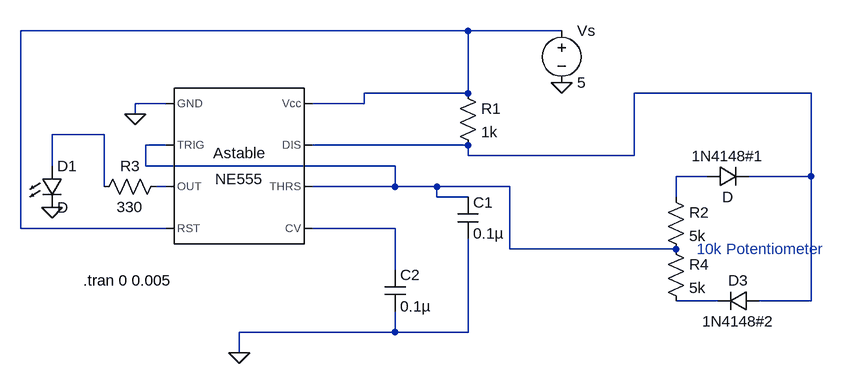
[diagram p0: schematic tj led schematic.asc]
tj led schematic.asc, the LTspice schematic file:
Version 4.1
SHEET 1 1116 680
WIRE 544 -32 -144 -32
WIRE 688 -32 544 -32
WIRE 544 64 544 -32
WIRE 544 64 384 64
WIRE 1072 64 800 64
WIRE 80 80 32 80
WIRE 384 80 384 64
WIRE 384 80 304 80
WIRE 32 96 32 80
WIRE -16 128 -96 128
WIRE 80 144 48 144
WIRE 544 144 304 144
WIRE 544 160 544 144
WIRE 800 160 800 64
WIRE 800 160 544 160
WIRE -96 176 -96 128
WIRE 48 176 48 144
WIRE 432 176 48 176
WIRE 912 192 864 192
WIRE 1072 192 1072 64
WIRE 1072 192 976 192
WIRE -16 208 -16 128
WIRE 80 208 64 208
WIRE 432 208 432 176
WIRE 432 208 304 208
WIRE 496 208 432 208
WIRE 608 208 496 208
WIRE 496 224 496 208
WIRE 544 224 496 224
WIRE 864 224 864 192
WIRE -144 272 -144 -32
WIRE 80 272 -144 272
WIRE 432 272 304 272
WIRE 608 304 608 208
WIRE 864 304 608 304
WIRE 432 336 432 272
WIRE 928 384 864 384
WIRE 1072 384 1072 192
WIRE 1072 384 992 384
WIRE 432 432 432 400
WIRE 432 432 192 432
WIRE 544 432 544 288
WIRE 544 432 432 432
WIRE 192 464 192 432
FLAG 688 48 0
FLAG 32 96 0
FLAG 192 464 0
FLAG -96 240 0
SYMBOL Misc\\NE555 192 176 R0
SYMATTR InstName Astable
SYMBOL cap 528 224 R0
SYMATTR InstName C1
SYMATTR Value 0.1µ
SYMBOL cap 416 336 R0
SYMATTR InstName C2
SYMATTR Value 0.1µ
SYMBOL voltage 688 -48 R0
SYMATTR InstName Vs
SYMATTR Value 5
SYMBOL LED -112 176 R0
SYMATTR InstName D1
SYMBOL res 528 48 R0
SYMATTR InstName R1
SYMATTR Value 1k
SYMBOL res 80 192 R90
WINDOW 0 0 56 VBottom 2
WINDOW 3 32 56 VTop 2
SYMATTR InstName R3
SYMATTR Value 330
SYMBOL res 848 208 R0
SYMATTR InstName R2
SYMATTR Value 5k
SYMBOL res 848 288 R0
SYMATTR InstName R4
SYMATTR Value 5k
SYMBOL diode 912 208 R270
WINDOW 0 32 32 VTop 2
WINDOW 3 0 32 VBottom 2
SYMATTR InstName 1N4148#1
SYMBOL diode 992 368 R90
WINDOW 0 0 32 VBottom 2
WINDOW 3 32 32 VTop 2
SYMATTR InstName D3
SYMATTR Value 1N4148#2
TEXT -48 352 Left 2 !.tran 0 0.005
TEXT 896 304 Left 2 ;10k Potentiometer

The netlist it stands for:
* tj led schematic.asc
X§Astable 0 N004 N006 N001 N007 N004 N002 N001 NE555  ; pins GND TRIG OUT RST CV THRS DIS Vcc
C1 N004 0 0.1µ
C2 N007 0 0.1µ
Vs N001 0 5
D1 N003 0 D
R1 N001 N002 1k
R3 N006 N003 330
R2 N005 N004 5k
R4 N004 N008 5k
D§1N4148#1 N005 N002 D
D3 N002 N008 1N4148#2
.model D D
.lib standard.dio
.tran 0 0.005
* 10k Potentiometer
.lib NE555.sub
.backanno
.end